# EAGLE design TB1 (EAGLE 5.10)
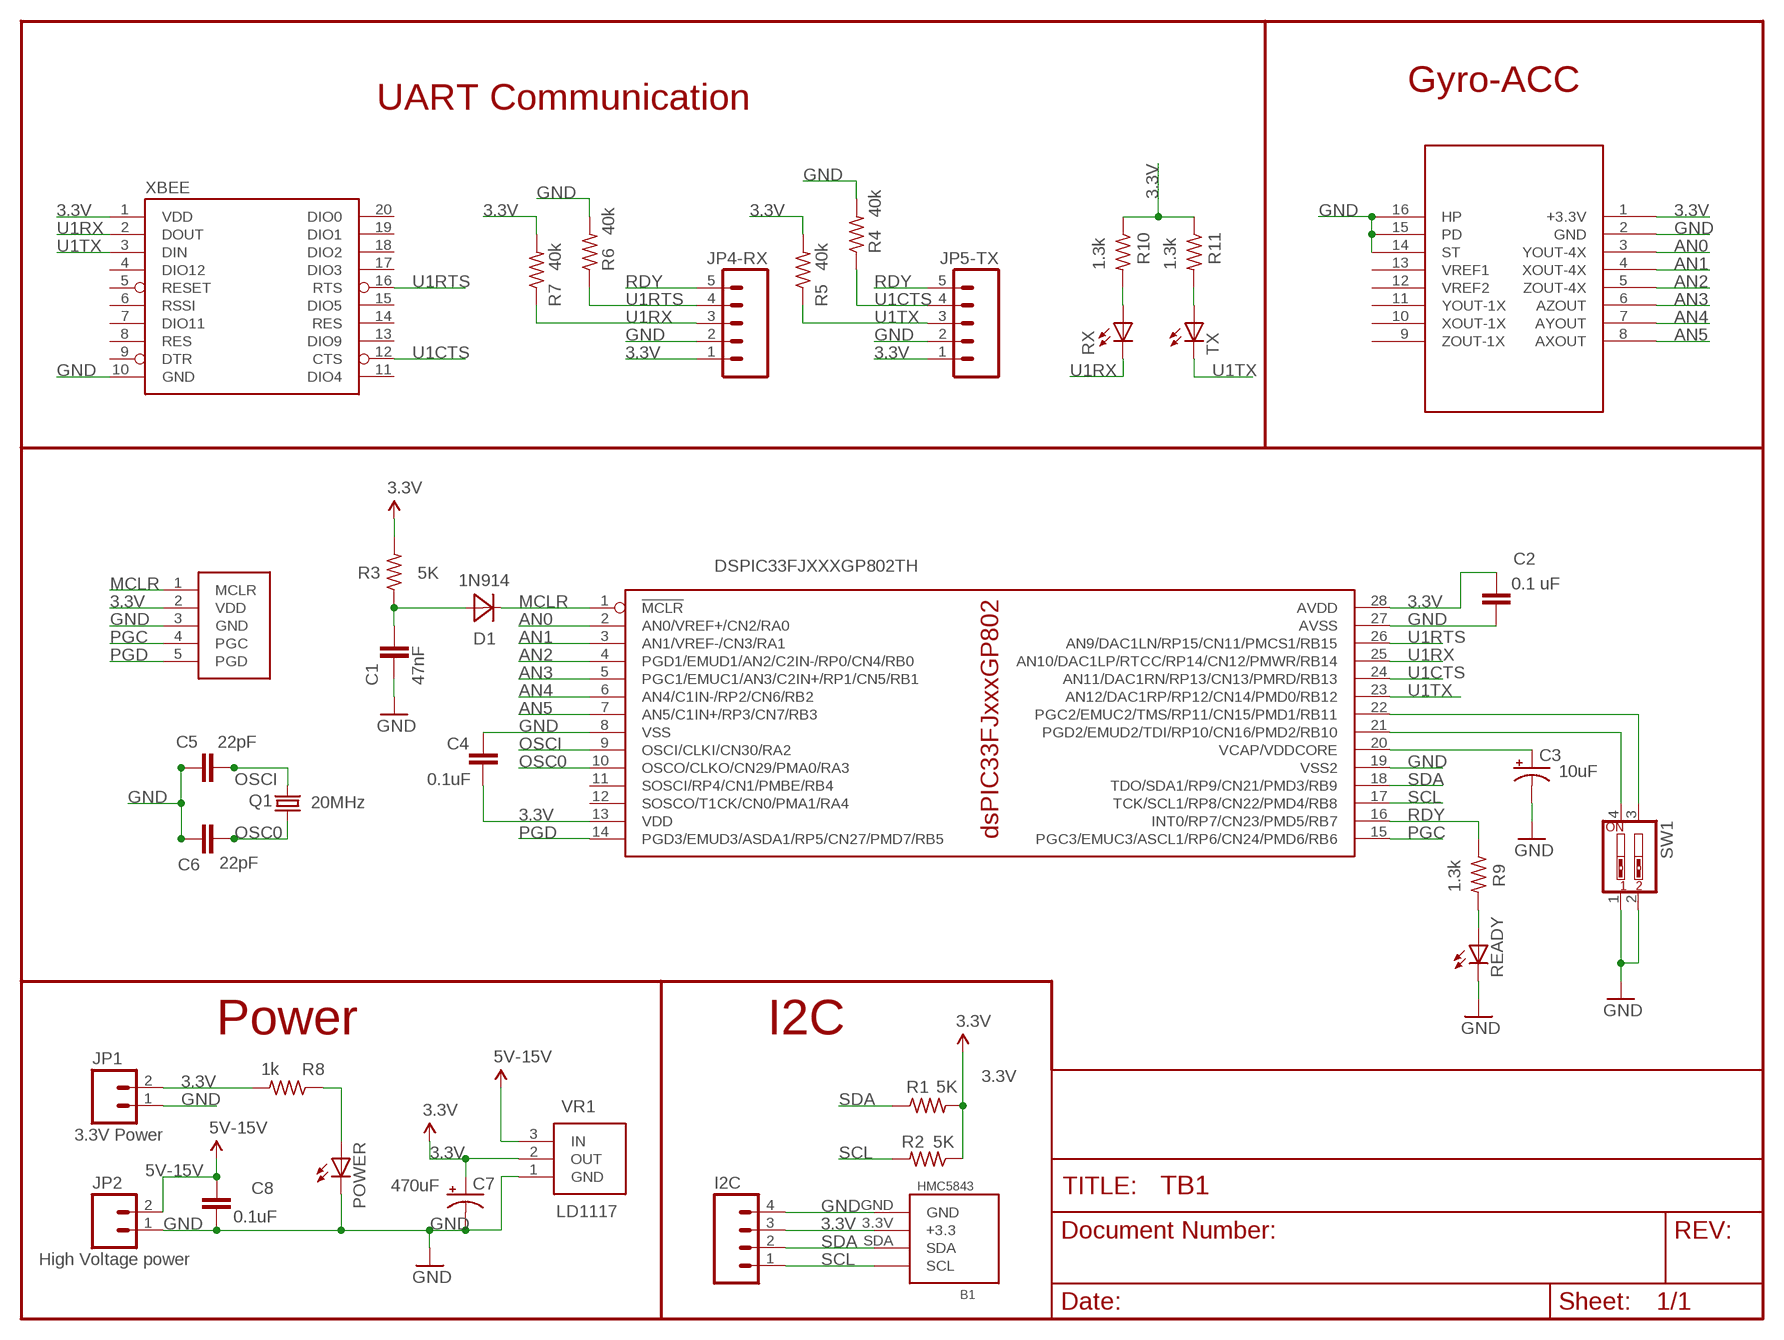
[diagram p0: schematic, sheet 1]

## Parts
6DOF1  6DOF-RAZOR  [6DOF-RAZOR]
B1  HMC5843  HMC5843-BREAKOUTSPARKFUN_BREAKOUT  [HMC5843-BREAKOUT]
C1  47nF  CAPPTH  [CAP-PTH-SMALL]
C2  0.1 uF  CAPPTH  [CAP-PTH-SMALL]
C3  10uF  CPOL-USE2-5  [E2-5]
C4  0.1uF  CAPPTH  [CAP-PTH-SMALL]
C5  22pF  CAPPTH  [CAP-PTH-SMALL]
C6  22pF  CAPPTH  [CAP-PTH-SMALL]
C7  470uF  CPOL-USE3.5-8  [E3,5-8]
C8  0.1uF  CAPPTH  [CAP-PTH-SMALL]
D1  1N914  [DO34-5]
I2C  M04POLAR_LOCK  [MOLEX-1X4_LOCK]
IC1  DSPIC33FJXXXGP802TH  [DIL28-3]
ICSP  ICSPMOLEX  [ICSP_LONGPADS_MOLEX]
JP1  3.3V Power  M02  [1X02_LONGPADS]
JP2  High Voltage power  M02  [1X02_LONGPADS]
JP4-RX  M05PTH_LONGPADS  [1X05_LONGPADS]
JP5-TX  M05PTH_LONGPADS  [1X05_LONGPADS]
POWER  LED5MM  [LED5MM]
Q1  20MHz  CRYSTALHC49US  [HC49US]
R1  5K  R-US_0204/7  [0204/7]
R2  5K  R-US_0204/7  [0204/7]
R3  5K  R-US_0204/7  [0204/7]
R4  40k  R-US_0204/7  [0204/7]
R5  40k  R-US_0204/7  [0204/7]
R6  40k  R-US_0204/7  [0204/7]
R7  40k  R-US_0204/7  [0204/7]
R8  1k  R-US_0204/7  [0204/7]
R9  1.3k  R-US_0204/7  [0204/7]
R10  1.3k  R-US_0204/7  [0204/7]
R11  1.3k  R-US_0204/7  [0204/7]
READY  LED3MM  [LED3MM]
RX  LED3MM  [LED3MM]
SW1  SW_DIP-2  [DIPSWITCH-02]
TX  LED3MM  [LED3MM]
VR1  LD1117  [TO220S]
XBEE  XBEE-1XBEE-1_LOCK  [XBEE-1_LOCK]

## Nets
3.3V: 6DOF1.1(+3.3V) B1.3.3V(+3.3) C2.2 C4.1 C7.+ I2C.3 IC1.13(VDD) IC1.28(AVDD) ICSP.2(VDD) JP1.2 JP4-RX.1 JP5-TX.1 R1.2 R2.1 R3.2 R5.2 R7.2 R8.2 R10.1 R11.1 VR1.2(OUT) XBEE.1(VDD)
5V-15V: C8.2 JP2.2 VR1.3(IN)
AN0: 6DOF1.3(YOUT-4X) IC1.2(AN0/VREF+/CN2/RA0)
AN1: 6DOF1.4(XOUT-4X) IC1.3(AN1/VREF-/CN3/RA1)
AN2: 6DOF1.5(ZOUT-4X) IC1.4(PGD1/EMUD1/AN2/C2IN-/RP0/CN4/RB0)
AN3: 6DOF1.6(AZOUT) IC1.5(PGC1/EMUC1/AN3/C2IN+/RP1/CN5/RB1)
AN4: 6DOF1.7(AYOUT) IC1.6(AN4/C1IN-/RP2/CN6/RB2)
AN5: 6DOF1.8(AXOUT) IC1.7(AN5/C1IN+/RP3/CN7/RB3)
GND: 6DOF1.2(GND) 6DOF1.14(ST) 6DOF1.15(PD) 6DOF1.16(HP) B1.GND C1.1 C2.1 C3.- C4.2 C5.1 C6.1 C7.- C8.1 I2C.4 IC1.8(VSS) IC1.19(VSS2) IC1.27(AVSS) ICSP.3(GND) JP1.1 JP2.1 JP4-RX.2 JP5-TX.2 POWER.K(C) R4.2 R6.2 READY.K(C) SW1.1 SW1.2 VR1.1(GND) XBEE.10(GND)
MCLR: D1.C IC1.1(!MCLR) ICSP.1(MCLR)
N$1: C1.2 D1.A R3.1
N$2: C3.+ IC1.20(VCAP/VDDCORE)
N$3: R11.2 TX.A
N$4: R10.2 RX.A
N$5: POWER.A R8.1
N$6: R9.2 READY.A
N$9: IC1.21(PGD2/EMUD2/TDI/RP10/CN16/PMD2/RB10) SW1.4
N$10: IC1.22(PGC2/EMUC2/TMS/RP11/CN15/PMD1/RB11) SW1.3
OSC0: C6.2 IC1.10(OSCO/CLKO/CN29/PMA0/RA3) Q1.1
OSCI: C5.2 IC1.9(OSCI/CLKI/CN30/RA2) Q1.2
PGC: IC1.15(PGC3/EMUC3/ASCL1/RP6/CN24/PMD6/RB6) ICSP.4(PGC)
PGD: IC1.14(PGD3/EMUD3/ASDA1/RP5/CN27/PMD7/RB5) ICSP.5(PGD)
RDY: IC1.16(INT0/RP7/CN23/PMD5/RB7) JP4-RX.5 JP5-TX.5 R9.1
SCL: B1.SCL I2C.1 IC1.17(TCK/SCL1/RP8/CN22/PMD4/RB8) R2.2
SDA: B1.SDA I2C.2 IC1.18(TDO/SDA1/RP9/CN21/PMD3/RB9) R1.1
U1CTS: IC1.24(AN11/DAC1RN/RP13/CN13/PMRD/RB13) JP5-TX.4 R4.1 XBEE.12(CTS)
U1RTS: IC1.26(AN9/DAC1LN/RP15/CN11/PMCS1/RB15) JP4-RX.4 R6.1 XBEE.16(RTS)
U1RX: IC1.25(AN10/DAC1LP/RTCC/RP14/CN12/PMWR/RB14) JP4-RX.3 R7.1 RX.K(C) XBEE.2(DOUT)
U1TX: IC1.23(AN12/DAC1RP/RP12/CN14/PMD0/RB12) JP5-TX.3 R5.1 TX.K(C) XBEE.3(DIN)
Unconnected: 6DOF1.9(ZOUT-1X) 6DOF1.10(XOUT-1X) 6DOF1.11(YOUT-1X) 6DOF1.12(VREF2) 6DOF1.13(VREF1) IC1.11(SOSCI/RP4/CN1/PMBE/RB4) IC1.12(SOSCO/T1CK/CN0/PMA1/RA4) XBEE.4(DIO12) XBEE.5(RESET) XBEE.6(RSSI) XBEE.7(DIO11) XBEE.8(RES) XBEE.9(DTR) XBEE.11(DIO4) XBEE.13(DIO9) XBEE.14(RES) XBEE.15(DIO5) XBEE.17(DIO3) XBEE.18(DIO2) XBEE.19(DIO1) XBEE.20(DIO0)

## Notes on the sheet
- Gyro-ACC
- UART Communication
- Power | I2C

## Library data of the parts
6DOF1 = AZ Custom:6DOF-RAZOR
B1 = AZ Custom:HMC5843-BREAKOUT
C1 C2 C4-C6 C8 = SparkFun:CAP: Capacitor Standard 0603 ceramic capacitor, and 0.1" leaded capacitor.
C3 C7 = rcl:CPOL-US: POLARIZED CAPACITOR, American symbol
D1 = AZ Custom:1N914
I2C = SparkFun:M04: Header 4 Standard 4-pin 0.1" header. Use with straight break away headers (SKU : PRT-00116), right angle break away headers (PRT-00553), swiss pins (PRT-00743), machine pins (PRT-00117), and female headers (PRT-00115). Molex polarized connector foot print use with SKU : PRT-08231 with associated crimp pins and housings.
IC1 = AZ Custom:DSPIC33FJXXXGP802: High-Performance, 16-bit Digital Signal Controllers - dsPIC33FJ64GP802 & dsPIC33FJ128GP802 Source: http://ww1.microchip.com/downloads/en/DeviceDoc/70292B.pdf Operating Range: . Up to 40 MIPS operation (at 3.0-3.6V): - Industrial temperature range (-40°C to +85°C) - Extended temperature range (-40°C to +125°C) High-Performance DSC CPU: . Modified Harvard architecture . C compiler optimized instruction set . 16-bit wide data path . 24-bit wide instructions . Linear program memory addressing up to 4M instruction words . Linear data memory addressing up to 64 Kbytes . 83 base instructions: mostly 1 word/1 cycle . Two 40-bit accumulators with rounding and saturation options . Flexible and powerful addressing modes: - Indirect - Modulo - Bit-Reversed . Software stack . 16 x 16 fractional/integer multiply operations . 32/16 and 16/16 divide operations . Single-cycle multiply and accumulate: - Accumulator write back for DSP operations - Dual data fetch . Up to ±16-bit shifts for up to 40-bit data On-Chip Flash and SRAM: . Flash program memory . Data SRAM . Boot, Secure, and General Security for program Flash Direct Memory Access (DMA): . 8-channel hardware DMA . Up to 2 Kbytes dual ported DMA buffer area (DMA RAM) to store data transferred via DMA: - Allows data transfer between RAM and a peripheral while CPU is executing code (no cycle stealing) . Most peripherals support DMA Timers/Capture/Compare/PWM: . Timer/Counters, up to five 16-bit timers: - Can pair up to make two 32-bit timers - One timer runs as a Real-Time Clock with an external 32.768 kHz oscillator - Programmable prescaler . Input Capture (up to four channels): - Capture on up, down or both edges - 16-bit capture input functions - 4-deep FIFO on each capture . Output Compare (up to four channels): - Single or Dual 16-bit Compare mode - 16-bit Glitchless PWM mode . Hardware Real-Time Clock/Calendar (RTCC): - Provides clock, calendar, and alarm functions Interrupt Controller: . 5-cycle latency . 118 interrupt vectors . Up to 49 available interrupt sources . Up to three external interrupts . Seven programmable priority levels . Five processor exceptions Digital I/O: . Peripheral pin Select functionality . Up to 35 programmable digital I/O pins . Wake-up/Interrupt-on-Change for up to 21 pins . Output pins can drive from 3.0V to 3.6V . Up to 5V output with open drain configuration . All digital input pins are 5V tolerant . 4 mA sink on all I/O pins System Management: . Flexible clock options: - External, crystal, resonator, internal RC - Fully integrated Phase-Locked Loop (PLL) - Extremely low jitter PLL . Power-up Timer . Oscillator Start-up Timer/Stabilizer . Watchdog Timer with its own RC oscillator . Fail-Safe Clock Monitor . Reset by multiple sources Power Management: . On-chip 2.5V voltage regulator . Switch between clock sources in real time . Idle, Sleep, and Doze modes with fast wake-up Analog-to-Digital Converters (ADCs): . 10-bit, 1.1 Msps or 12-bit, 500 Ksps conversion: - Two and four simultaneous samples (10-bit ADC) - Up to 13 input channels with auto-scanning - Conversion start can be manual or synchronized with one of four trigger sources - Conversion possible in Sleep mode - ±2 LSb max integral nonlinearity - ±1 LSb max differential nonlinearity Audio Digital-to-Analog Converter (DAC): . 16-bit Dual Channel DAC module . 100 Ksps maximum sampling rate . Second-Order Digital Delta-Sigma Modulator Data Converter Interface (DCI) module: . Codec interface . Supports I2S and AC.97 protocols . Up to 16-bit data words, up to 16 words per frame . 4-word deep TX and RX buffers Comparator Module: . Two analog comparators with programmable input/output configuration CMOS Flash Technology: . Low-power, high-speed Flash technology . Fully static design . 3.3V (±10%) operating voltage . Industrial and Extended temperature . Low power consumption Communication Modules: . 4-wire SPI (up to two modules): - Framing supports I/O interface to simple codecs - Supports 8-bit and 16-bit data - Supports all serial clock formats and sampling modes . I2C?: - Full Multi-Master Slave mode support - 7-bit and 10-bit addressing - Bus collision detection and arbitration - Integrated signal conditioning - Slave address masking . UART (up to two modules): - Interrupt on address bit detect - Interrupt on UART error - Wake-up on Start bit from Sleep mode - 4-character TX and RX FIFO buffers - LIN bus support - IrDA® encoding and decoding in hardware - High-Speed Baud mode - Hardware Flow Control with CTS and RTS . Enhanced CAN (ECAN. module) 2.0B active: - Up to eight transmit and up to 32 receive buffers - 16 receive filters and three masks - Loopback, Listen Only and Listen All - Messages modes for diagnostics and bus monitoring - Wake-up on CAN message - Automatic processing of Remote Transmission Requests - FIFO mode using DMA - DeviceNet. addressing support . Parallel Master Slave Port (PMP/EPSP): - Supports 8-bit or 16-bit data - Supports 16 address lines . Programmable Cyclic Redundancy Check (CRC): - Programmable bit length for the CRC generator polynomial (up to 16-bit length) - 8-deep, 16-bit or 16-deep, 8-bit FIFO for data input
ICSP = AZ Custom:ICSP
JP1 JP2 = SparkFun:M02: Header 2 Standard 2-pin 0.1" header. Use with straight break away headers (SKU : PRT-00116), right angle break away headers (PRT-00553), swiss pins (PRT-00743), machine pins (PRT-00117), and female headers (PRT-00115). Molex polarized connector foot print use with SKU : PRT-08233 with associated crimp pins and housings.
JP4-RX JP5-TX = SparkFun:M05: Header 5 Standard 5-pin 0.1" header. Use with straight break away headers (SKU : PRT-00116), right angle break away headers (PRT-00553), swiss pins (PRT-00743), machine pins (PRT-00117), and female headers (PRT-00115). Molex polarized connector foot print use with SKU : PRT-08230 with associated crimp pins and housings.
POWER READY RX TX = SparkFun:LED: LEDs Standard schematic elements and footprints for 5mm, 3mm, 1206, and 0603 sized LEDs. 5mm - Spark Fun Electronics SKU : COM-00529 (and others)
Q1 = SparkFun:CRYSTAL: Crystals Various standard crystals. Proven footprints. Spark Fun Electronics SKU : COM-00534
R1-R11 = resistor:R-US_: RESISTOR, American symbol
SW1 = SparkFun:SW_DIP-2: DIP SWITCH
VR1 = AZ Custom:LD1117: LD1117 series voltage regulator (including LD33V)
XBEE = AZ Custom:XBEE-1

## Board
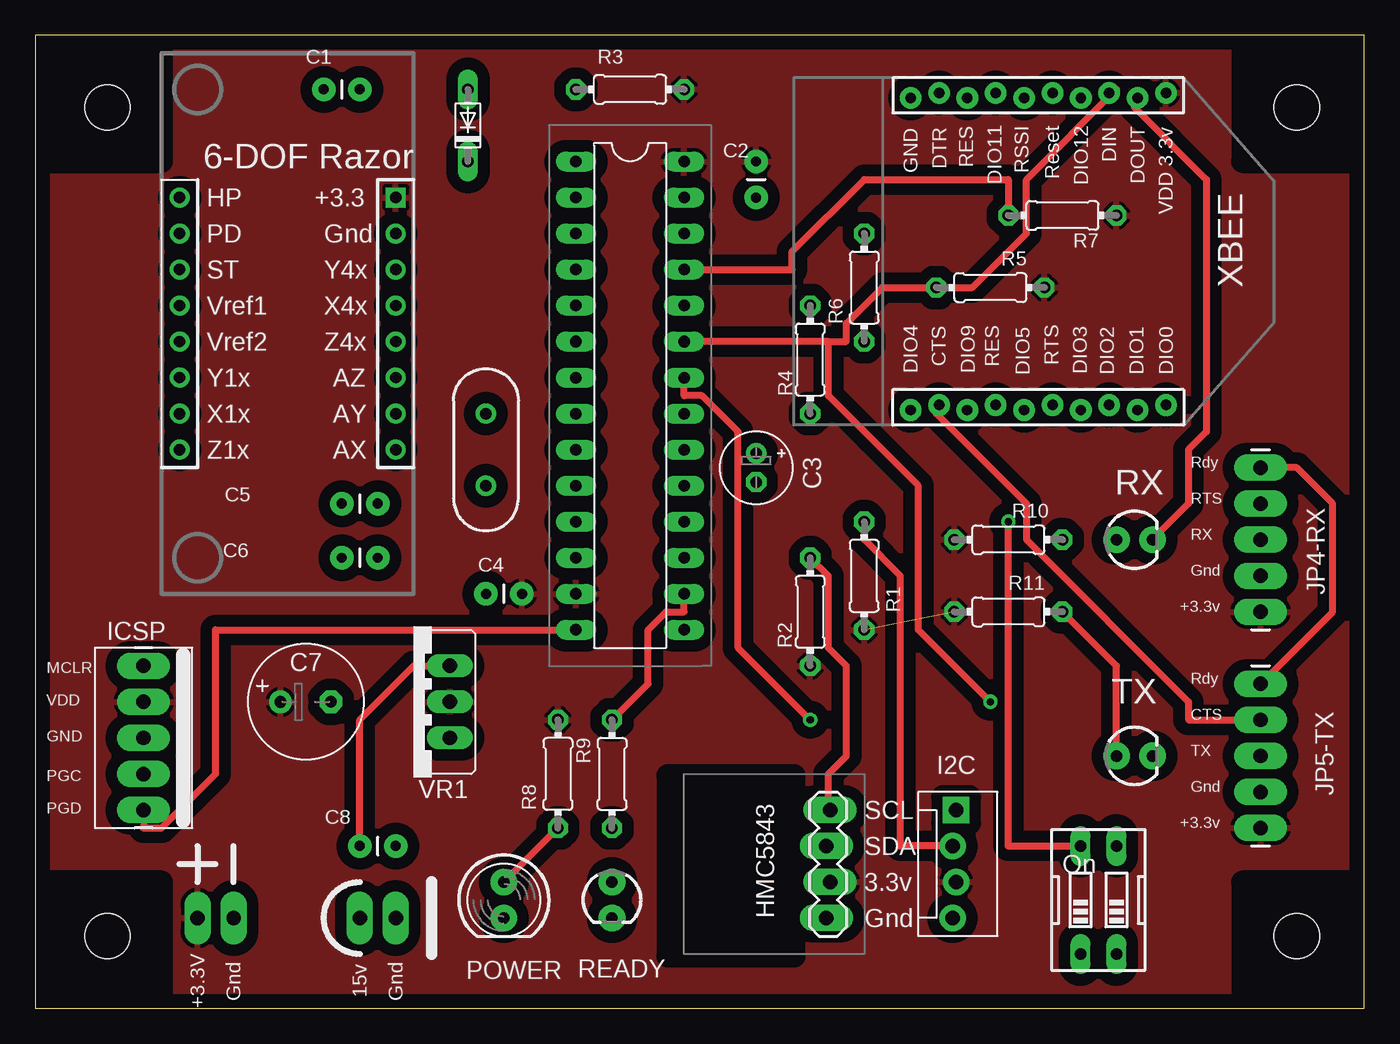
[diagram p1: board, top side]
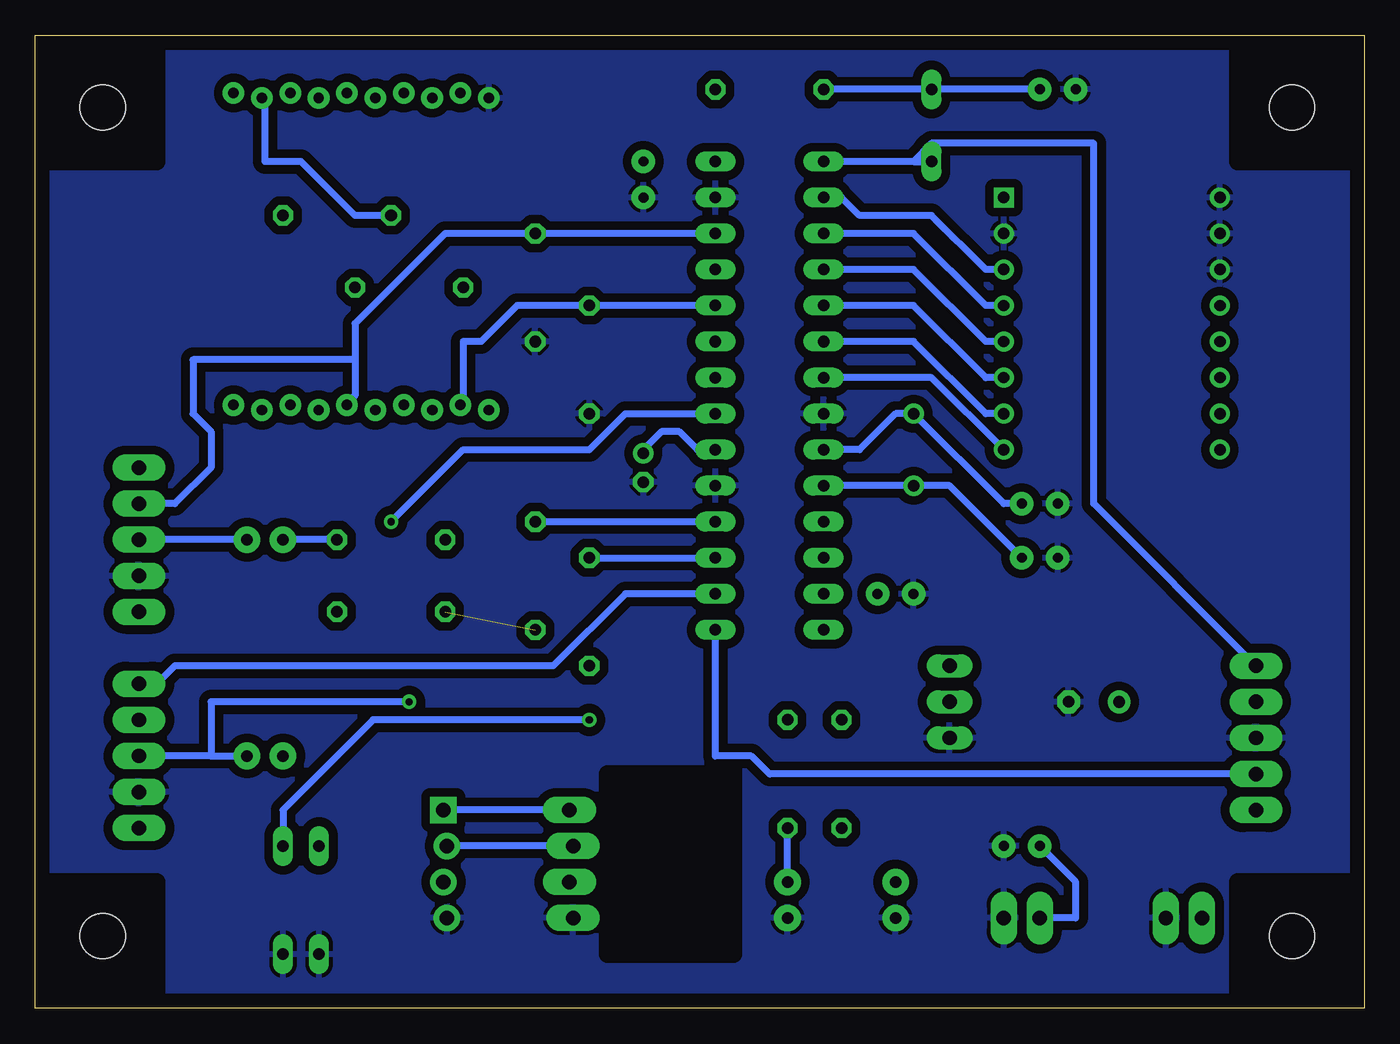
[diagram p2: board, bottom side, seen from below]

Size 93.65 x 68.57 mm. Coordinates in mm from the lower left corner, seen from the top.
Outline: 0,0 93.65,0 93.65,68.57 0,68.57 0,0
Copper layers (1*16): Top 0.035mm / dielectric 1.5mm / Bottom 0.035mm
Design rules "AZCustom": minimum track width 20mil, minimum drill 20mil, track to track 12mil, track to pad 12mil, pad to pad 12mil, via to via 8mil, smd to smd 8mil, copper to edge 40mil, drill to drill 12mil, minimum pad ring 12mil, minimum via ring 10mil, stop-mask expansion 4mil, vias tented up to drill 25mil, thermal gap 10mil
Holes 3.2 mm at 5.08,5.08 5.08,63.5 88.9,63.5 88.9,5.08
tRestrict: area 0,0 to 8.9,8.9; area 85.1,0 to 94,8.9; area 85.1,59.7 to 94,68.6; area 0,59.7 to 8.9,68.6; area 44.6,3.7 to 53.5,16.4
bRestrict: area 0,59.7 to 8.9,68.6; area 0,0 to 8.9,8.9; area 85.1,59.7 to 94,68.6; area 85.1,0 to 94,8.9; area 44.4,3.8 to 53.3,16.5; area 0,0 to 8.9,8.9

### Footprints (pad centres in the part's own frame; a part is rotated, then mirrored left to right if it is on the bottom)
6DOF-RAZOR = drill 0.8 square: 1 7.62,8.89 | drill 0.8 round: 2 7.62,6.35; 3 7.62,3.81; 4 7.62,1.27; 5 7.62,-1.27; 6 7.62,-3.81; 7 7.62,-6.35; 8 7.62,-8.89; 9 -7.62,-8.89; 10 -7.62,-6.35; 11 -7.62,-3.81; 12 -7.62,-1.27; 13 -7.62,1.27; 14 -7.62,3.81; 15 -7.62,6.35; 16 -7.62,8.89
HMC5843-BREAKOUT = drill 1.016 pad 1.88 long: 3.3V 3.937,-1.27; GND 3.683,-3.81; SCL 3.937,3.81; SDA 3.683,1.27
CAP-PTH-SMALL = drill 0.7 pad 1.651 round: 1 0,0; 2 2.54,0
E2-5 = drill 0.813 pad 1.27 round: + -1.016,0 | drill 0.813 pad 1.27 octagon: - 1.016,0
E3,5-8 = drill 0.813 pad 1.6 round: + -1.778,0 | drill 0.813 pad 1.6 octagon: - 1.778,0
DO34-5 = drill 0.813 long: A 2.54,0; C -2.54,0
MOLEX-1X4_LOCK = drill 1.016 pad 1.88 square: 1 0,0.127 | drill 1.016 pad 1.88 round: 2 2.54,-0.127; 3 5.08,0.127; 4 7.62,-0.127
DIL28-3 = drill 0.813 long: 1 -16.51,-3.81; 2 -13.97,-3.81; 3 -11.43,-3.81; 4 -8.89,-3.81; 5 -6.35,-3.81; 6 -3.81,-3.81; 7 -1.27,-3.81; 8 1.27,-3.81; 9 3.81,-3.81; 10 6.35,-3.81; 11 8.89,-3.81; 12 11.43,-3.81; 13 13.97,-3.81; 14 16.51,-3.81; 15 16.51,3.81; 16 13.97,3.81; 17 11.43,3.81; 18 8.89,3.81; 19 6.35,3.81; 20 3.81,3.81; 21 1.27,3.81; 22 -1.27,3.81; 23 -3.81,3.81; 24 -6.35,3.81; 25 -8.89,3.81; 26 -11.43,3.81; 27 -13.97,3.81; 28 -16.51,3.81
ICSP_LONGPADS_MOLEX = drill 1.016 pad 1.88 long: 1 0,5.08; 2 0,2.54; 3 0,0; 4 0,-2.54; 5 0,-5.08
1X02_LONGPADS = drill 1.016 pad 1.88 long: 1 0,0; 2 2.54,0
1X05_LONGPADS = drill 1.016 pad 1.88 long: 1 0,0; 2 2.54,0; 3 5.08,0; 4 7.62,0; 5 10.16,0
LED5MM = drill 0.813 pad 1.88 round: A -1.27,0; K 1.27,0
HC49US = drill 0.813 round: 1 -2.54,0; 2 2.54,0
0204/7 = drill 0.813 octagon: 1 -3.81,0; 2 3.81,0
LED3MM = drill 0.813 pad 1.88 round: A -1.27,0; K 1.27,0
DIPSWITCH-02 = drill 0.813 long: 1 -1.27,-3.81; 2 1.27,-3.81; 3 1.27,3.81; 4 -1.27,3.81
TO220S = drill 1.016 long: 1 -5.08,1.27; 2 -2.54,1.27; 3 0,1.27
XBEE-1_LOCK = drill 0.737 pad 1.524 round: 1 -11.178,20; 2 -10.822,18; 3 -11.178,16; 4 -10.822,14; 5 -11.178,12; 6 -10.822,10; 7 -11.178,8; 8 -10.822,6; 9 -11.178,4; 10 -10.822,2; 11 11.178,2; 12 10.822,4; 13 11.178,6; 14 10.822,8; 15 11.178,10; 16 10.822,12; 17 11.178,14; 18 10.822,16; 19 11.178,18; 20 10.822,20

### Placement (x,y rotation side)
6DOF1  17.78,48.26 0 top
B1  52.07,10.16 0 top
C1  20.32,64.77 0 top
C2  50.8,57.15 90 top
C3  50.8,38.1 270 top
C4  34.29,29.21 180 top
C5  21.59,35.56 0 top
C6  21.59,31.75 0 top
C7  19.05,21.59 0.1 top
C8  25.4,11.43 180 top
D1  30.48,62.23 90 top
I2C  64.77,13.97 270 top
IC1  41.91,43.18 270 top
ICSP  7.62,19.05 0 top
JP1  13.97,6.35 180 top
JP2  25.4,6.35 180 top
JP4-RX  86.36,27.94 90 top
JP5-TX  86.36,12.7 90 top
POWER  33.02,7.62 270 top
Q1  31.75,39.37 90 top
R1  58.42,30.48 270 top
R2  54.61,27.94 90 top
R3  41.91,64.77 0 top
R4  54.61,45.72 270 top
R5  67.31,50.8 0 top
R6  58.42,50.8 270 top
R7  72.39,55.88 0 top
R8  36.83,16.51 90 top
R9  40.64,16.51 270 top
R10  68.58,33.02 0 top
R11  68.58,27.94 0 top
READY  40.64,7.62 270 top
RX  77.47,33.02 0 top
SW1  74.93,7.62 0 top
TX  77.47,17.78 0 top
VR1  30.48,24.13 90 top
XBEE  59.69,53.34 270 top

### Tracks (layer width: path | path; a pad name or v marks a point on that pad's centre or on a via)
3.3V  (1 unrouted)
  pour Top (isolate 0.813): 0,68.58 93.98,68.58 93.98,0 0,0
5V-15V
  Top 0.508: VR1.3 26.67,24.13 22.86,20.32 C8.2
  Bottom 0.508: C8.2 20.32,8.89 20.32,6.35 JP2.2
AN0
  Bottom 0.508: 6DOF1.3 26.67,52.07 30.48,55.88 35.56,55.88 36.83,57.15 IC1.2
AN1
  Bottom 0.508: 6DOF1.4 26.67,49.53 31.75,54.61 IC1.3
AN2
  Bottom 0.508: 6DOF1.5 26.67,46.99 31.75,52.07 IC1.4
AN3
  Bottom 0.508: 6DOF1.6 26.67,44.45 31.75,49.53 IC1.5
AN4
  Bottom 0.508: 6DOF1.7 26.67,41.91 31.75,46.99 IC1.6
AN5
  Bottom 0.508: 6DOF1.8 30.48,44.45 IC1.7
GND
  pour Bottom (isolate 0.61): 0,68.58 93.98,68.58 93.98,67.31 93.98,0 0,0
MCLR
  Bottom 0.508: 31.75,59.69 IC1.1 | 31.75,59.69 D1.C | ICSP.1 19.05,35.56 19.05,60.96 30.48,60.96 31.75,59.69
N$1
  Bottom 0.508: C1.2 D1.A R3.1
N$2
  Bottom 0.508: IC1.20 46.99,39.37 48.26,40.64 49.53,40.64 50.8,39.37 C3.+
N$3
  Top 0.508: R11.2 76.2,24.13 TX.A
N$4
  Bottom 0.508: R10.2 RX.A
N$5
  Top 0.508: POWER.A R8.1
N$6
  Bottom 0.508: READY.A R9.2
N$9  (via drill 0.51)
  Top 0.508: SW1.4 68.58,11.43 v68.58,34.29
  Bottom 0.508: v68.58,34.29 63.5,39.37 54.61,39.37 52.07,41.91 IC1.21
N$10  (via drill 0.51)
  Top 0.508: v54.61,20.32 49.53,25.4 49.53,40.64 46.99,43.18 45.72,43.18 IC1.22
  Bottom 0.508: SW1.3 76.2,13.97 69.85,20.32 v54.61,20.32
OSC0
  Bottom 0.508: C6.2 29.21,36.83 Q1.1 IC1.10
OSCI
  Bottom 0.508: C5.2 25.4,35.56 Q1.2 33.02,41.91 35.56,39.37 IC1.9
PGC
  Bottom 0.508: IC1.15 45.72,17.78 43.18,17.78 41.91,16.51 ICSP.4
PGD
  Top 0.508: IC1.14 12.7,26.67 12.7,16.51 8.89,12.7 7.62,12.7 ICSP.5
RDY
  Top 0.508: R9.1 43.18,22.86 43.18,26.67 44.45,27.94 45.72,27.94 IC1.16 | JP5-TX.5 91.44,27.94 91.44,35.56 88.9,38.1 JP4-RX.5
  Bottom 0.508: IC1.16 52.07,29.21 57.15,24.13 83.82,24.13 85.09,22.86 JP5-TX.5
SCL
  Top 0.508: R2.2 55.88,30.48 55.88,25.4 57.15,24.13 57.15,17.78 55.88,16.51 55.88,13.97 B1.SCL
  Bottom 0.508: R2.2 IC1.17 | B1.SCL I2C.1
SDA
  Top 0.508: R1.1 58.42,33.02 60.96,30.48 60.96,11.43 I2C.2 64.77,11.43
  Bottom 0.508: B1.SDA I2C.2 64.77,11.43 | R1.1 IC1.18
U1CTS
  Top 0.508: JP5-TX.4 81.28,20.32 81.28,21.59 69.85,33.02 69.85,35.56 63.5,41.91 XBEE.12
  Bottom 0.508: XBEE.12 63.5,43.18 63.5,46.99 62.23,46.99 59.69,49.53 R4.1 IC1.24
U1RTS
  Bottom 0.508: 71.12,45.72 71.12,48.26 64.77,54.61 R6.1 IC1.26 | 71.12,45.72 71.12,43.18 XBEE.16 | JP4-RX.4 83.82,35.56 81.28,38.1 81.28,40.64 82.55,41.91 82.55,45.72 71.12,45.72
U1RX
  Top 0.508: IC1.25 53.34,52.07 53.34,53.34 58.42,58.42 68.58,58.42 R7.1 | RX.K 81.28,35.56 81.28,39.37 82.55,40.64 82.55,58.42 77.47,63.5 XBEE.2
  Bottom 0.508: RX.K JP4-RX.3 | R7.1 71.12,55.88 74.93,59.69 77.47,59.69 77.47,63.5 XBEE.2
U1TX  (via drill 0.51)
  Top 0.508: XBEE.3 76.2,64.77 69.85,58.42 69.85,54.61 66.04,50.8 R5.1 59.69,50.8 57.15,48.26 57.15,46.99 55.88,46.99 | 55.88,46.99 IC1.23 | v67.31,21.59 62.23,26.67 62.23,36.83 55.88,43.18 55.88,46.99
  Bottom 0.508: 81.28,17.78 JP5-TX.3 | 81.28,17.78 TX.K | 81.28,17.78 81.28,21.59 v67.31,21.59

### Text on the board
tPlace: Rdy | RTS | RX | Gnd | +3.3v | Rdy | CTS | TX | I2C | Gnd | +3.3v | On | Gnd | 15v | Gnd | +3.3V